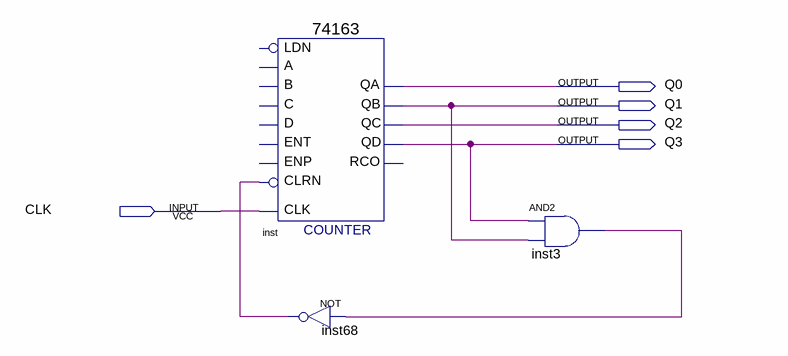
[diagram p0: schematic sheet]
// Quartus schematic Exp04_Cont2.bdf as structural Verilog: 3 symbols, 5 pins
module Exp04_Cont2 (
  input  CLK,
  output Q0,
  output Q1,
  output Q2,
  output Q3
);

  wire inst3_out, inst68_out;

  \74163  inst (
    .CLRN(inst68_out), .CLK(CLK), .QA(Q0), .QB(Q1), .QC(Q2), .QD(Q3));  // open: C, B, A, ENT, D, ENP, LDN, RCO
  not inst68 (inst68_out, inst3_out);
  and inst3 (inst3_out, Q3, Q1);
endmodule
